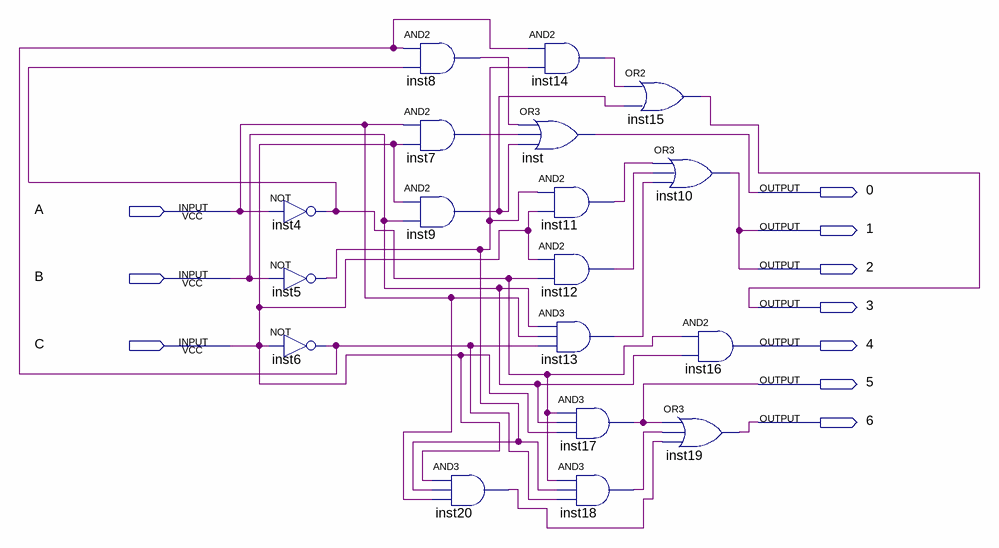
[diagram p0: schematic sheet]
// Quartus schematic Lab2.bdf as structural Verilog: 18 symbols, 10 pins
module Lab2 (
  input  A,
  input  B,
  input  C,
  output \0 ,
  output \1 ,
  output \2 ,
  output \3 ,
  output \4 ,
  output \5 ,
  output \6 
);

  wire inst4_out, inst5_out, inst6_out, inst7_out, inst8_out, inst9_out, inst11_out, inst12_out, inst13_out,
       inst14_out, inst18_out, inst20_out;

  not inst4 (inst4_out, A);
  not inst5 (inst5_out, B);
  not inst6 (inst6_out, C);
  and inst8 (inst8_out, inst6_out, inst4_out);
  and inst7 (inst7_out, A, C);
  and inst9 (inst9_out, C, B);
  and inst20 (inst20_out, C, inst5_out, A);
  and inst14 (inst14_out, inst6_out, inst5_out);
  or inst (\0 , inst8_out, inst7_out, inst9_out);
  and inst11 (inst11_out, inst5_out, C);
  and inst12 (inst12_out, C, inst4_out);
  and inst13 (inst13_out, B, A, inst6_out);
  and inst17 (\5 , inst4_out, B, C);
  and inst18 (inst18_out, inst4_out, inst5_out, inst6_out);
  or inst15 (\3 , inst14_out, inst9_out);
  or inst10 (\1 , inst11_out, inst12_out, inst13_out);
  and inst16 (\4 , inst4_out, B);
  or inst19 (\6 , \5 , inst18_out, inst20_out);

  assign \2  = \1 ;
endmodule
